# EAGLE design ATtiny LED badge (EAGLE 9.1.0)
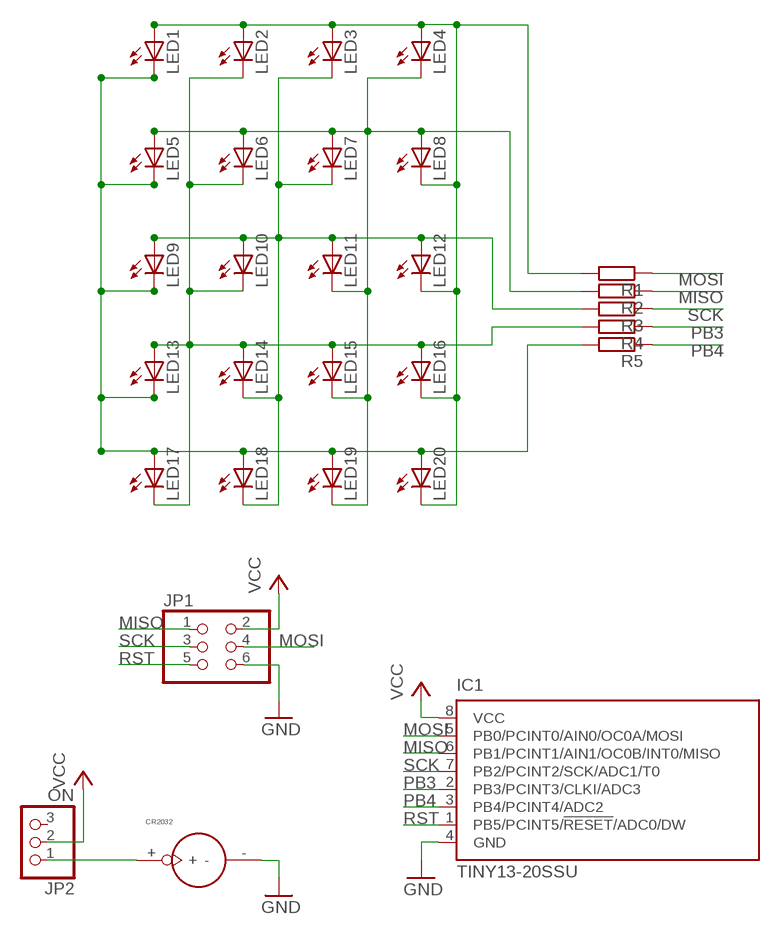
[diagram p0: schematic, sheet 1]

## Parts
CR2032  BATTERY_1236_C  [BATTERY_1236_C]
IC1  TINY13-20SSU  [8S1]
JP1  PINHD-2X3  [2X03]
JP2  ON  PINHD-1X3  [1X03]
LED1  LED3MM  [LED3MM]
LED2  LED3MM  [LED3MM]
LED3  LED3MM  [LED3MM]
LED4  LED3MM  [LED3MM]
LED5  LED3MM  [LED3MM]
LED6  LED3MM  [LED3MM]
LED7  LED3MM  [LED3MM]
LED8  LED3MM  [LED3MM]
LED9  LED3MM  [LED3MM]
LED10  LED3MM  [LED3MM]
LED11  LED3MM  [LED3MM]
LED12  LED3MM  [LED3MM]
LED13  LED3MM  [LED3MM]
LED14  LED3MM  [LED3MM]
LED15  LED3MM  [LED3MM]
LED16  LED3MM  [LED3MM]
LED17  LED3MM  [LED3MM]
LED18  LED3MM  [LED3MM]
LED19  LED3MM  [LED3MM]
LED20  LED3MM  [LED3MM]
R1  R-EU_0207/7  [0207/7]
R2  R-EU_0207/7  [0207/7]
R3  R-EU_0207/7  [0207/7]
R4  R-EU_0207/7  [0207/7]
R5  R-EU_0207/7  [0207/7]

## Nets
GND: CR2032.- IC1.4(GND) JP1.6
MISO: IC1.6(PB1/PCINT1/AIN1/OC0B/INT0/MISO) JP1.1 R2.1
MOSI: IC1.5(PB0/PCINT0/AIN0/OC0A/MOSI) JP1.4 R1.1
N$1: LED1.A LED2.A LED3.A LED4.A LED8.K(C) LED12.K(C) LED16.K(C) LED20.K(C) R1.2
N$2: LED4.K(C) LED5.A LED6.A LED7.A LED8.A LED11.K(C) LED15.K(C) LED19.K(C) R2.2
N$3: LED3.K(C) LED7.K(C) LED9.A LED10.A LED11.A LED12.A LED14.K(C) LED18.K(C) R3.2
N$4: LED2.K(C) LED6.K(C) LED10.K(C) LED13.A LED14.A LED15.A LED16.A LED17.K(C) R4.2
N$5: LED1.K(C) LED5.K(C) LED9.K(C) LED13.K(C) LED17.A LED18.A LED19.A LED20.A R5.2
N$6: CR2032.+ JP2.1
PB3: IC1.2(PB3/PCINT3/CLKI/ADC3) R4.1
PB4: IC1.3(PB4/PCINT4/ADC2) R5.1
RST: IC1.1(PB5/PCINT5/!RESET!/ADC0/DW) JP1.5
SCK: IC1.7(PB2/PCINT2/SCK/ADC1/T0) JP1.3 R3.1
VCC: IC1.8(VCC) JP1.2 JP2.2
Unconnected: JP2.3

## Library data of the parts
CR2032 = Itead_BP_110825.lbr:BATTERY_1236_C: SOC004
IC1 = atmel:TINY13: 8-bit AVR Microcontroller with 1K Bytes In-System Programmable Flash Source: http://www.atmel.com/dyn/resources/prod_documents/2535S.pdf; MPN: ATTINY13-20SSU; OC_FARNELL: 1455133; OC_NEWARK: 58M3771
JP1 = pinhead:PINHD-2X3: PIN HEADER
JP2 = pinhead:PINHD-1X3: PIN HEADER
LED1-LED20 = led:LED: LED OSRAM: - CHIPLED LG R971, LG N971, LY N971, LG Q971, LY Q971, LO R971, LY R971 LH N974, LH R974 LS Q976, LO Q976, LY Q976 LO Q996 - Hyper CHIPLED LW Q18S LB Q993, LB Q99A, LB R99A - SideLED LS A670, LO A670, LY A670, LG A670, LP A670 LB A673, LV A673, LT A673, LW A673 LH A674 LY A675 LS A676, LA A676, LO A676, LY A676, LW A676 LS A679, LY A679, LG A679 - Hyper Micro SIDELED® LS Y876, LA Y876, LO Y876, LY Y876 LT Y87S - SmartLED LW L88C, LW L88S LB L89C, LB L89S, LG L890 LS L89K, LO L89K, LY L89K LS L896, LA L896, LO L896, LY L896 - TOPLED LS T670, LO T670, LY T670, LG T670, LP T670 LSG T670, LSP T670, LSY T670, LOP T670, LYG T670 LG T671, LOG T671, LSG T671 LB T673, LV T673, LT T673, LW T673 LH T674 LS T676, LA T676, LO T676, LY T676, LB T676, LH T676, LSB T676, LW T676 LB T67C, LV T67C, LT T67C, LS T67K, LO T67K, LY T67K, LW E67C LS E67B, LA E67B, LO E67B, LY E67B, LB E67C, LV E67C, LT E67C LW T67C LS T679, LY T679, LG T679 LS T770, LO T770, LY T770, LG T770, LP T770 LB T773, LV T773, LT T773, LW T773 LH T774 LS E675, LA E675, LY E675, LS T675 LS T776, LA T776, LO T776, LY T776, LB T776 LHGB T686 LT T68C, LB T68C - Hyper Mini TOPLED® LB M676 - Mini TOPLED Santana® LG M470 LS M47K, LO M47K, LY M47K Source: http://www.osram.convergy.de LUXEON: - LUMILED® LXK2-PW12-R00, LXK2-PW12-S00, LXK2-PW14-U00, LXK2-PW14-V00 LXK2-PM12-R00, LXK2-PM12-S00, LXK2-PM14-U00 LXK2-PE12-Q00, LXK2-PE12-R00, LXK2-PE12-S00, LXK2-PE14-T00, LXK2-PE14-U00 LXK2-PB12-K00, LXK2-PB12-L00, LXK2-PB12-M00, LXK2-PB14-N00, LXK2-PB14-P00, LXK2-PB14-Q00 LXK2-PR12-L00, LXK2-PR12-M00, LXK2-PR14-Q00, LXK2-PR14-R00 LXK2-PD12-Q00, LXK2-PD12-R00, LXK2-PD12-S00 LXK2-PH12-R00, LXK2-PH12-S00 LXK2-PL12-P00, LXK2-PL12-Q00, LXK2-PL12-R00 Source: www.luxeon.com KINGBRIGHT: KA-3528ASYC Source: www.kingbright.com
R1-R5 = resistor:R-EU_: RESISTOR, European symbol

## Board
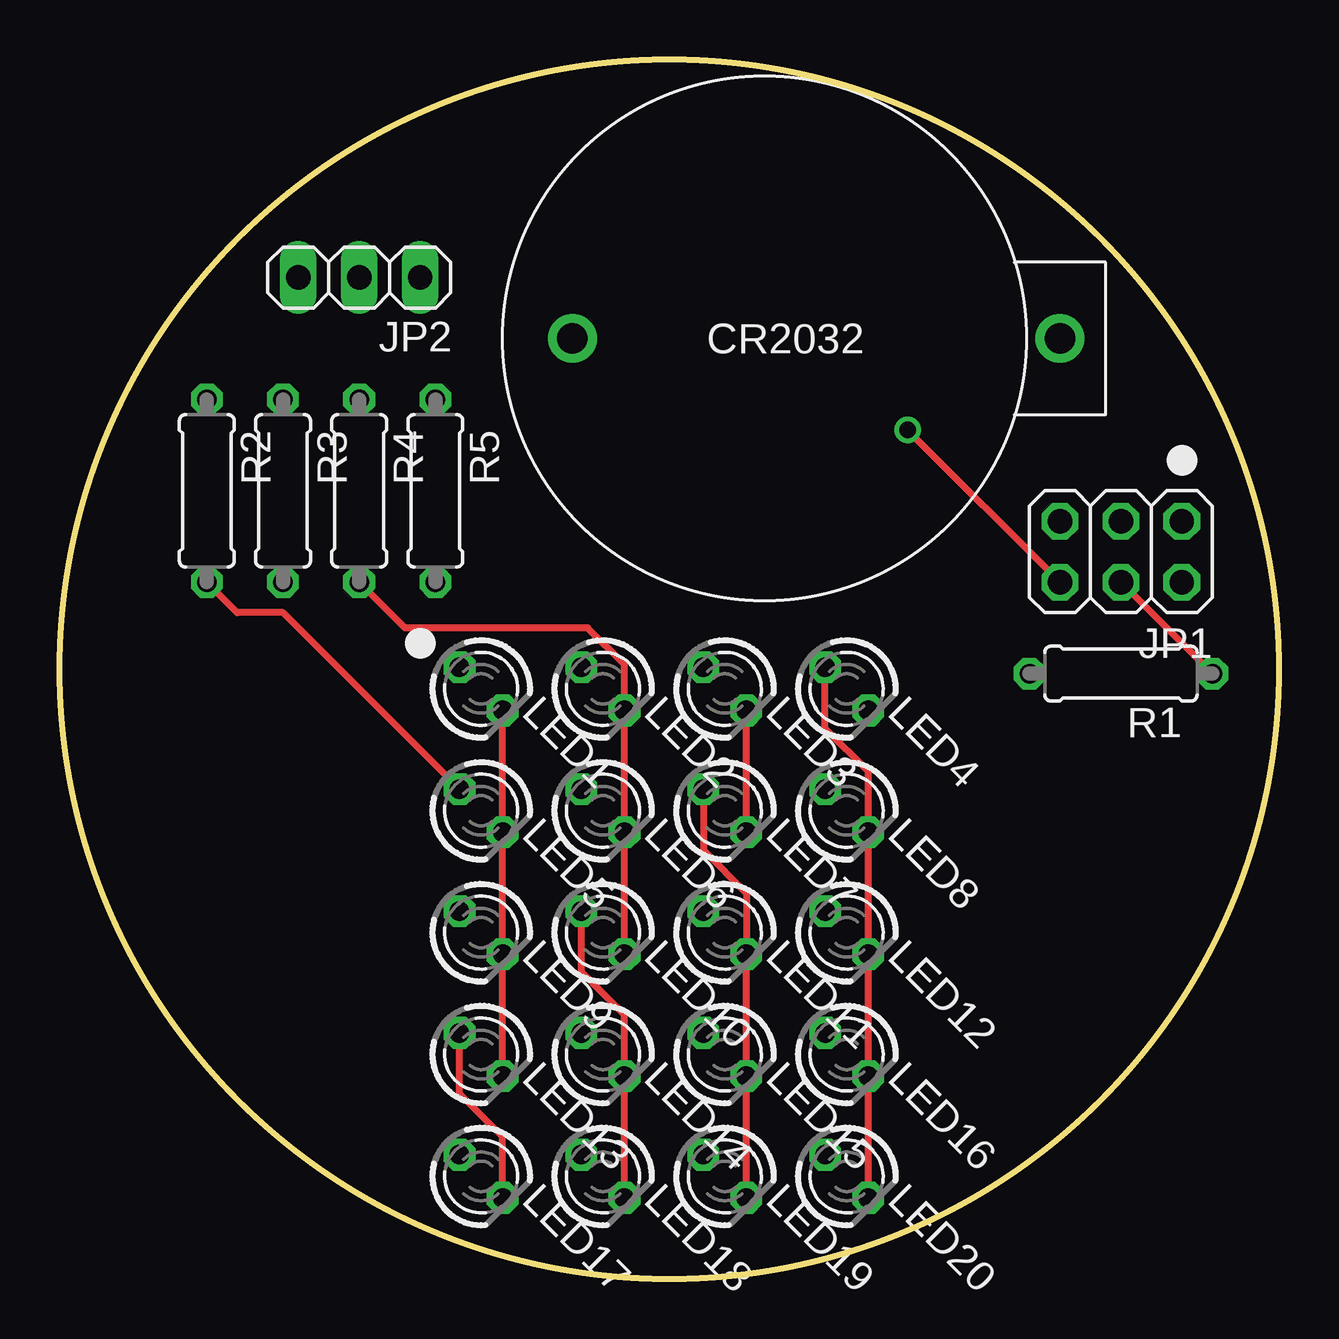
[diagram p1: board, top side]
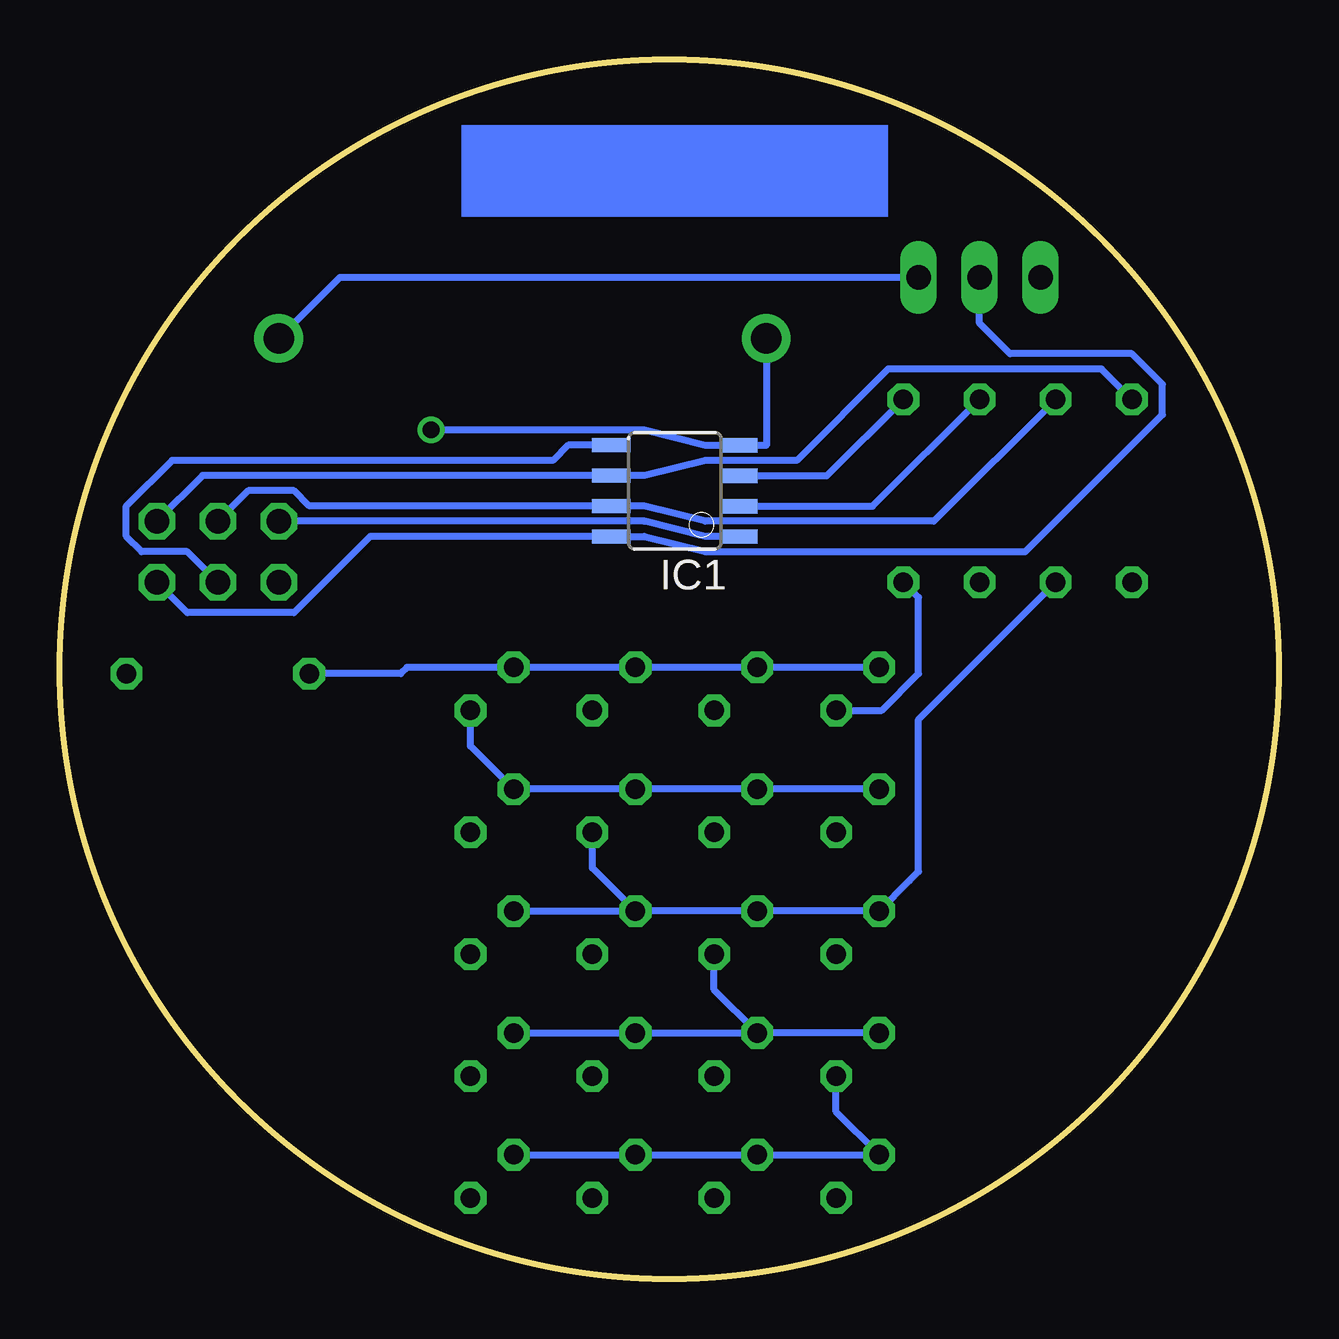
[diagram p2: board, bottom side, seen from below]

Size 50.8 x 50.8 mm. Coordinates in mm from the lower left corner, seen from the top.
Outline: circle at 25.4,25.4 radius 25.4
Copper layers (1*16): Top 0.035mm / dielectric 1.5mm / Bottom 0.035mm
Design rules "default": minimum track width 10mil, minimum drill 24mil, track to track 8mil, track to pad 8mil, pad to pad 8mil, via to via 8mil, smd to smd 8mil, copper to edge 40mil, drill to drill 8mil, minimum pad ring 10mil, minimum via ring 8mil, stop-mask expansion 4mil, vias tented up to drill 0mil, thermal gap 10mil

### Footprints (pad centres in the part's own frame; a part is rotated, then mirrored left to right if it is on the bottom)
BATTERY_1236_C = drill 1.27 pad 2.032: + 0,0; - 0,20.32
8S1 = smd 0.6 x 1.6: 1 -1.905,-2.654; 2 -0.645,-2.654; 3 0.625,-2.654; 4 1.895,-2.654; 5 1.905,2.654; 6 0.635,2.654; 7 -0.635,2.654; 8 -1.905,2.654
2X03 = drill 1.016 octagon: 1 -2.54,-1.27; 2 -2.54,1.27; 3 0,-1.27; 4 0,1.27; 5 2.54,-1.27; 6 2.54,1.27
1X03 = drill 1.016 long: 1 -2.54,0; 2 0,0; 3 2.54,0
LED3MM = drill 0.813 octagon: A -1.27,0; K 1.27,0
0207/7 = drill 0.813 octagon: 1 -3.81,0; 2 3.81,0

### Placement (x,y rotation side)
CR2032  41.68,39.19 90 top
IC1  25.17,32.84 90 bottom
JP1  44.22,30.3 180 top
JP2  12.47,41.73 180 top
LED1  17.55,24.59 315 top
LED2  22.63,24.59 315 top
LED3  27.71,24.59 315 top
LED4  32.79,24.59 315 top
LED5  17.55,19.51 315 top
LED6  22.63,19.51 315 top
LED7  27.71,19.51 315 top
LED8  32.79,19.51 315 top
LED9  17.55,14.43 315 top
LED10  22.63,14.43 315 top
LED11  27.71,14.43 315 top
LED12  32.79,14.43 315 top
LED13  17.55,9.35 315 top
LED14  22.63,9.35 315 top
LED15  27.71,9.35 315 top
LED16  32.79,9.35 315 top
LED17  17.55,4.27 315 top
LED18  22.63,4.27 315 top
LED19  27.71,4.27 315 top
LED20  32.79,4.27 315 top
R1  44.22,25.22 180 top
R2  6.12,32.84 270 top
R3  9.3,32.84 270 top
R4  12.47,32.84 270 top
R5  15.65,32.84 270 top

### Tracks (layer width: path | path; a pad name or v marks a point on that pad's centre or on a via)
GND  (via drill 0.7)
  Top 0.3: v35.33,35.38 JP1.6
  Bottom 0.3: CR2032.- 21.36,34.74 IC1.4 23.89,34.74 26.44,35.38 v35.33,35.38
MISO
  Bottom 0.3: R2.1 7.39,37.92 16.28,37.92 20.09,34.11 23.9,34.11 26.44,33.48 IC1.6 44.86,33.48 JP1.1
MOSI
  Top 0.3: R1.1 JP1.4
  Bottom 0.3: JP1.4 45.49,30.3 47.4,30.3 48.03,30.94 48.03,32.21 46.13,34.11 30.25,34.11 29.62,34.75 IC1.5
N$1
  Top 0.3: LED20.K LED16.K LED12.K LED8.K 33.69,21.15 31.89,22.95 LED4.A
  Bottom 0.3: LED1.A LED2.A LED3.A LED4.A 36.34,25.49 36.6,25.22 R1.2
N$2
  Top 0.3: LED19.K LED15.K LED11.K 28.61,16.07 26.81,17.87 LED7.A | LED5.A 9.3,27.76 7.39,27.76 R2.2
  Bottom 0.3: LED5.A LED6.A LED7.A LED8.A 33.69,22.2 LED4.K
N$3
  Top 0.3: LED7.K LED3.K | LED10.A 21.73,12.79 23.53,10.99 LED14.K LED18.K
  Bottom 0.3: LED11.A LED10.A LED9.A 15.38,16.6 15.01,16.97 15.01,23.32 R3.2 | LED11.A 28.61,17.12 LED7.K | LED12.A LED11.A
N$4
  Top 0.3: LED10.K LED6.K LED2.K 23.53,25.59 22,27.13 14.38,27.13 R4.2 | LED17.K 18.45,5.91 16.65,7.71 LED13.A
  Bottom 0.3: LED13.A LED14.A | LED14.A 23.53,12.04 LED10.K | LED16.A LED15.A LED14.A
N$5
  Top 0.3: LED13.K LED9.K LED5.K LED1.K
  Bottom 0.3: LED13.K 18.45,6.96 LED17.A LED18.A LED19.A LED20.A | LED1.K 16.54,23.69 15.01,25.22 15.01,28.4 R5.2
N$6
  Bottom 0.3: JP2.1 39.14,41.73 CR2032.+
PB3
  Bottom 0.3: IC1.2 16.93,32.2 R4.1
PB4
  Bottom 0.3: IC1.3 18.83,33.47 R5.1
RST
  Bottom 0.3: IC1.1 23.9,30.94 26.44,31.57 JP1.5
SCK
  Bottom 0.3: R3.1 14.38,31.57 23.9,31.57 26.44,32.21 IC1.7 40.41,32.21 41.05,32.84 42.95,32.84 JP1.3
VCC
  Bottom 0.3: JP1.2 45.49,27.76 41.05,27.76 37.87,30.94 IC1.8 26.44,30.94 23.9,30.3 10.57,30.3 4.85,36.02 4.85,37.29 6.12,38.56 11.2,38.56 12.47,39.83 JP2.2
(copper drawn outside any net)
  shapes: Bottom area x1